# EAGLE design led_board (EAGLE 5.91)
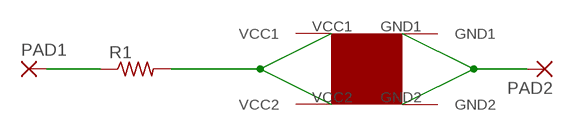
[diagram p0: schematic, sheet 1]

## Parts
PAD1  1,6/0,8  [1,6/0,8]
PAD2  1,6/0,8  [1,6/0,8]
R1  R-US_M1206  [M1206]
U$1  7.6X7.6_LED  [7.6X7.6MM_LED]

## Nets
GND: PAD2.1(P) U$1.GND1 U$1.GND2
N$1: R1.2 U$1.VCC1 U$1.VCC2
VCC: PAD1.1(P) R1.1

## Library data of the parts
PAD1 PAD2 = wirepad:1,6/0,8: THROUGH-HOLE PAD
R1 = resistor:R-US_: RESISTOR, American symbol
U$1 = MyLib:7.6X7.6_LED

## Board
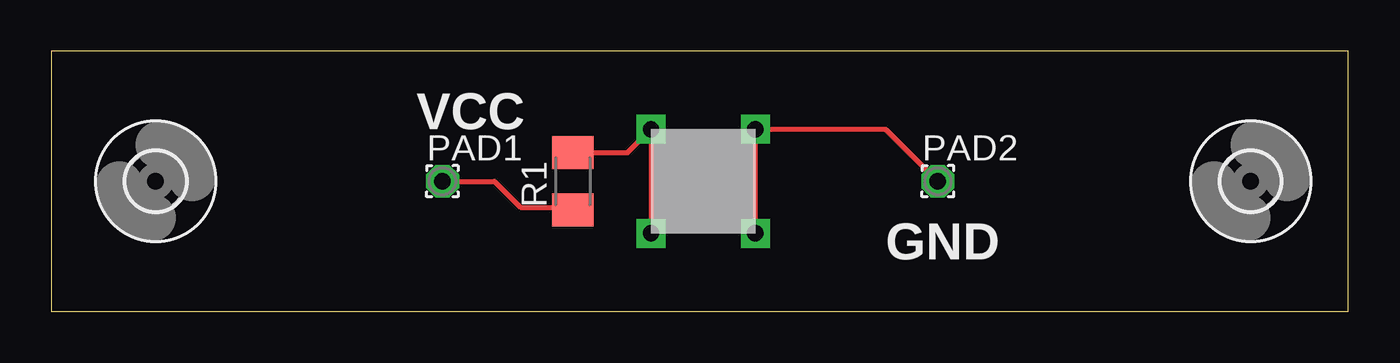
[diagram p1: board, top side]

Size 63.17 x 12.69 mm. Coordinates in mm from the lower left corner, seen from the top.
Outline: 0,0 63.17,0 63.17,12.69 0,12.69 0,0
Copper layers (1*16): Top 0.035mm / dielectric 1.5mm / Bottom 0.035mm
Design rules: minimum track width 8mil, minimum drill 20mil, track to track 8mil, track to pad 8mil, pad to pad 8mil, via to via 8mil, smd to smd 8mil, copper to edge 10mil, drill to drill 8mil, minimum pad ring 12mil, minimum via ring 10mil, stop-mask expansion 4mil, vias tented up to drill 25mil, thermal gap 10mil

### Footprints (pad centres in the part's own frame; a part is rotated, then mirrored left to right if it is on the bottom)
2,8 = hole 2.8: 0,0
1,6/0,8 = drill 0.813 pad 1.6 octagon: 1 0,0
M1206 = smd 1.6 x 2: 1 -1.4,0; 2 1.4,0
7.6X7.6MM_LED = drill 0.8 square: GND1 2.54,2.54; GND2 2.54,-2.54; VCC1 -2.54,2.54; VCC2 -2.54,-2.54

### Placement (x,y rotation side)
E$1  [2,8]  5.08,6.35 0 top
E$2  [2,8]  58.42,6.35 0 top
PAD1  19.05,6.35 0 top
PAD2  43.18,6.35 0 top
R1  25.4,6.35 90 top
U$1  31.75,6.35 0 top

### Tracks (layer width: path | path; a pad name or v marks a point on that pad's centre or on a via)
GND
  Top 0.254: U$1.GND2 U$1.GND1 40.64,8.89 PAD2.1
N$1
  Top 0.254: R1.2 28.07,7.75 U$1.VCC1 U$1.VCC2
VCC
  Top 0.254: PAD1.1 21.59,6.35 22.86,5.08 25.27,5.08 R1.1

### Text on the board
tPlace: VCC | GND